# EAGLE design 454_mic101 (EAGLE 9.6.0)
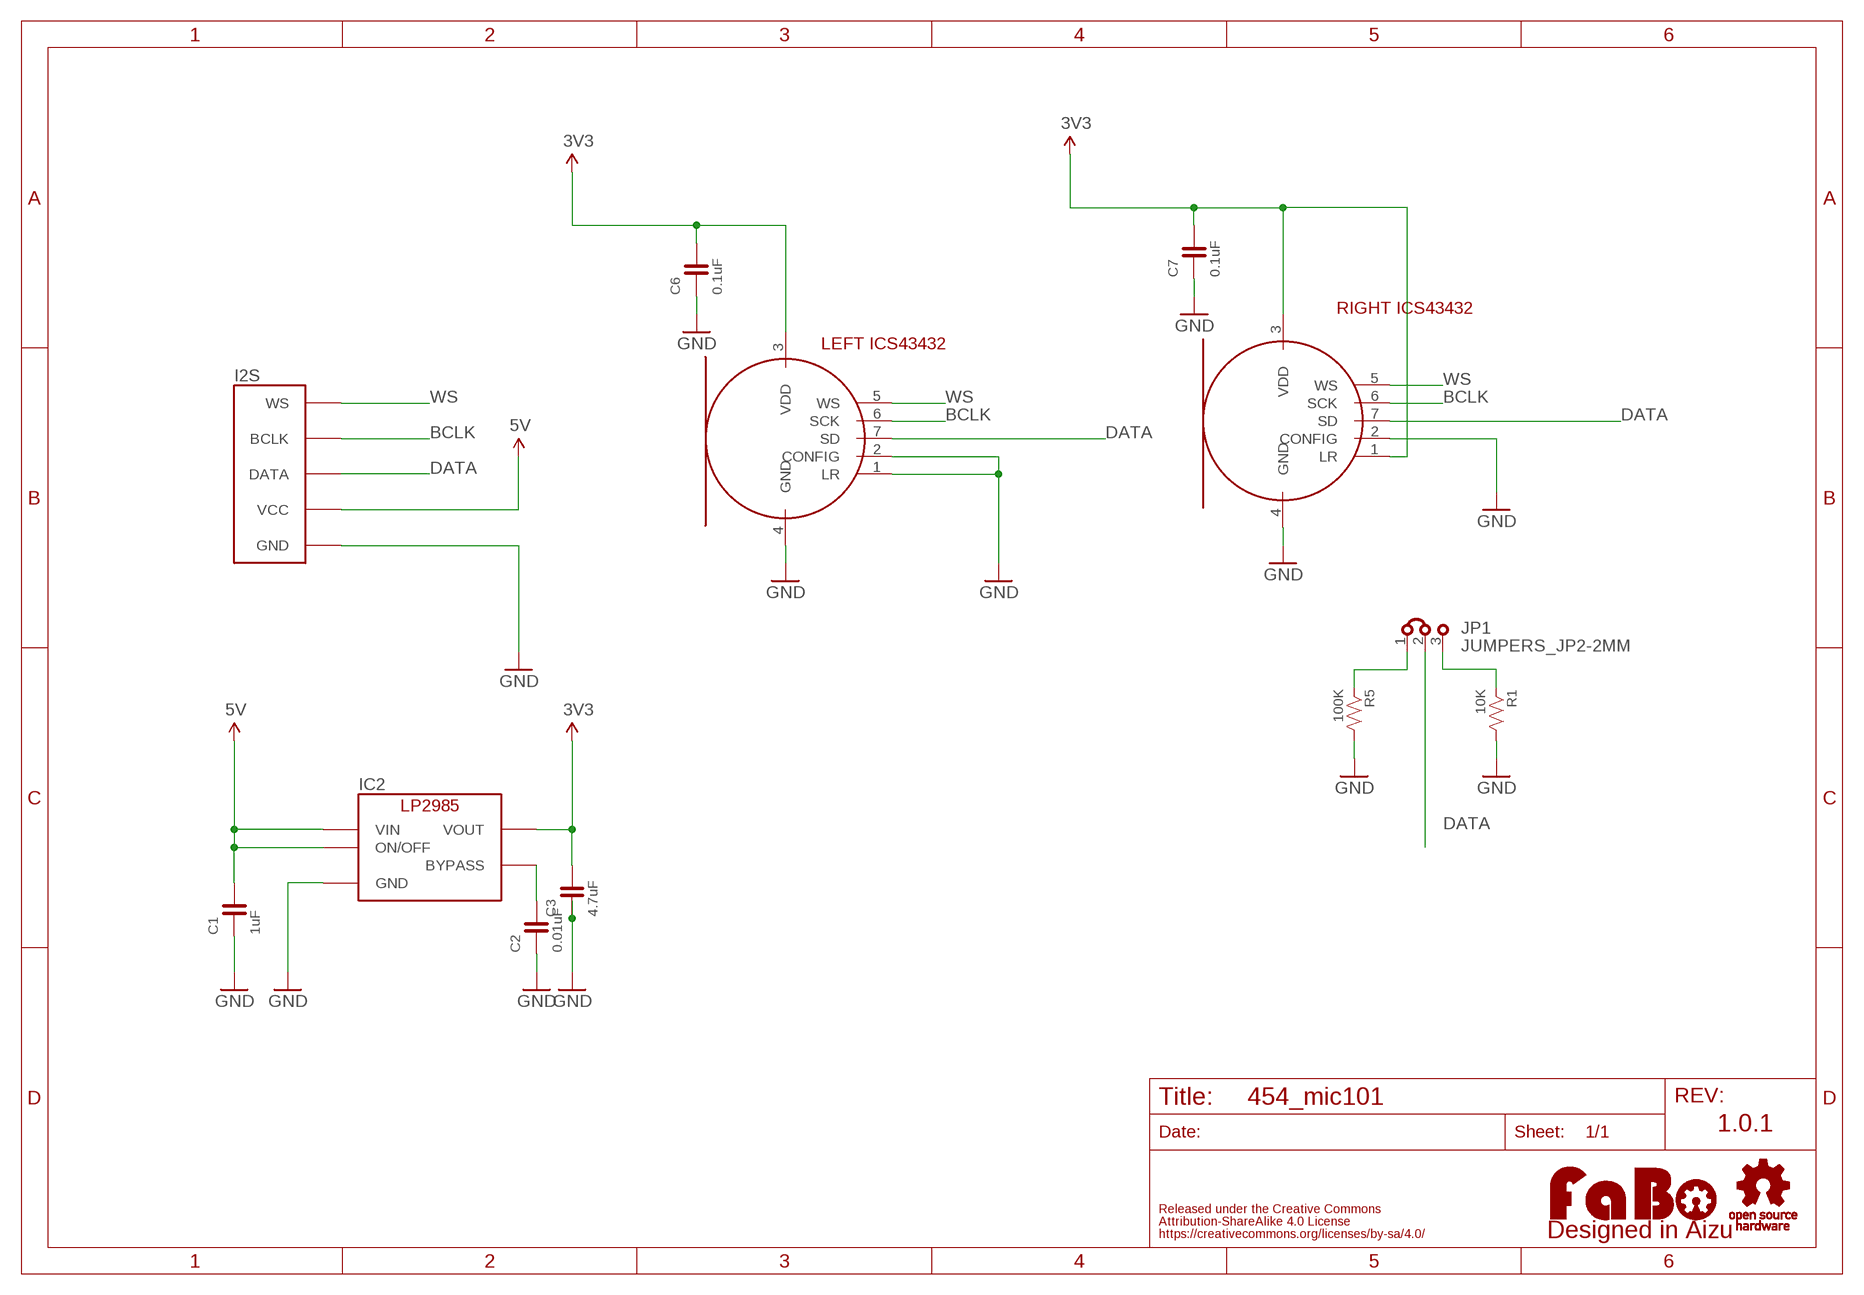
[diagram p0: schematic, sheet 1]

## Parts
C1  1uF  CAPACITOR-0603  [0603]
C2  0.01uF  CAPACITOR-0603  [0603]
C3  4.7uF  CAPACITOR-0603  [0603]
C6  0.1uF  CAPACITOR-0603  [0603]
C7  0.1uF  CAPACITOR-0603  [0603]
I2S  FABO_BRICK_I2STOP  [FABO_BRICK_I2S_B05B-PARK-1]
IC2  LP2985-33DBV  [SOT-23-5]
JP1  JUMPERS_JP2-2MM  [JUMPERS_JP2-2MM]
LOGO1  LOGO_FABO-M_BOTTOM  [LOGO_FABO_M_BOTTOM]
MIC_LEFT  TDK-ICS43432  [TDK-ICS43432]
MIC_RIGHT  TDK-ICS43432  [TDK-ICS43432]
R1  10K  RESISTOR-0603  [0603]
R5  100K  RESISTOR-0603  [0603]
U$2  LOGO_OSHW-M  [LOGO_OSHW_M]

## Nets
3V3: C3.2 C6.2 C7.2 IC2.5(VOUT) MIC_LEFT.3(VDD) MIC_RIGHT.1(LR) MIC_RIGHT.3(VDD)
5V: C1.2 I2S.VCC IC2.1(VIN) IC2.3(ON/OFF)
BCLK: I2S.BCLK MIC_LEFT.6(SCK) MIC_RIGHT.6(SCK)
DATA: I2S.DATA JP1.2 MIC_LEFT.7(SD) MIC_RIGHT.7(SD)
GND: C1.1 C2.1 C3.1 C6.1 C7.1 I2S.GND IC2.2(GND) MIC_LEFT.1(LR) MIC_LEFT.2(CONFIG) MIC_LEFT.4(GND) MIC_RIGHT.2(CONFIG) MIC_RIGHT.4(GND) R1.2 R5.2
N$1: C2.2 IC2.4(BYPASS)
N$2: JP1.1 R5.1
N$3: JP1.3 R1.1
WS: I2S.WS MIC_LEFT.5(WS) MIC_RIGHT.5(WS)

## Notes on the sheet
- RIGHT ICS43432
- LEFT ICS43432
- 1.0.1

## Library data of the parts
C1-C3 C6 C7 = FaBo-Capacitor:CAPACITOR: CAPACITOR
I2S = FaBo-Template:FABO_BRICK_I2S
IC2 = FaBo-Supply:LP2985: LP2985
JP1 = 52101-101-REV-A_v16:JUMPERS_JP2-: Jumper/Bridge
LOGO1 = component:LOGO_FABO
MIC_LEFT MIC_RIGHT = FaBo-Mems:TDK-ICS43432
R1 R5 = FaBo-Resistors:RESISTOR: RESISTOR
U$2 = component:LOGO_OSHW

## Board
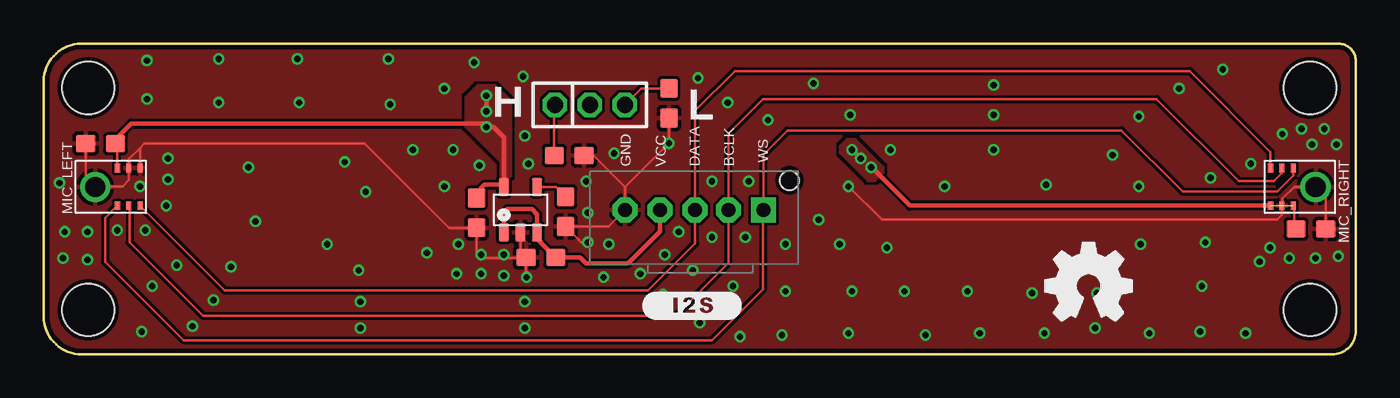
[diagram p1: board, top side]
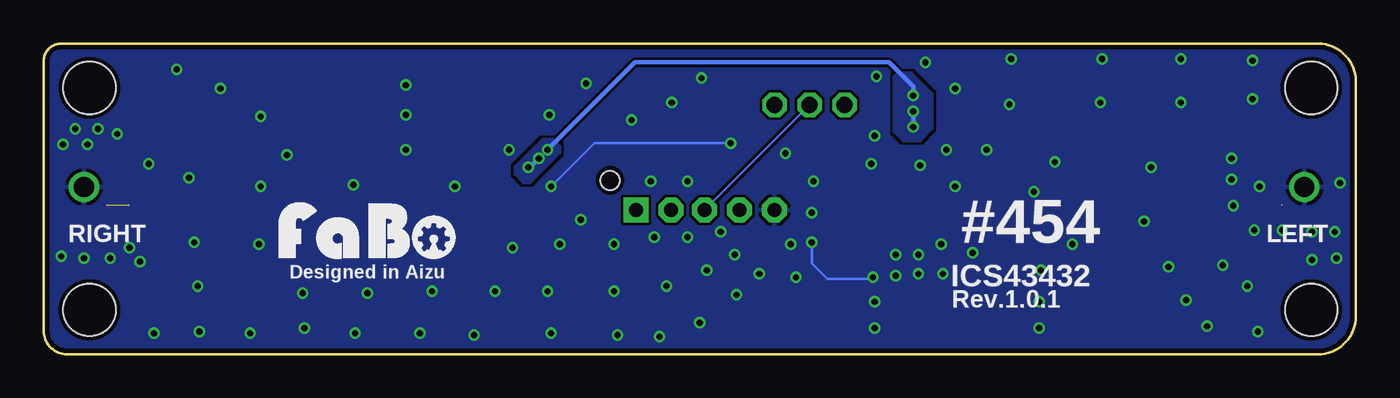
[diagram p2: board, bottom side, seen from below]

Size 75 x 17.77 mm. Coordinates in mm from the lower left corner, seen from the top.
Outline: 0,2.17 0,15.62 arc-90 2.15,17.77 74.01,17.77 arc-90 75,16.78 75,1.34 arc-90 73.66,0 2.17,0 arc-90 0,2.17
Copper layers (1*16): Top 0.035mm / dielectric 1.6mm / Bottom 0.035mm
Design rules "PCBway": minimum track width 6mil, minimum drill 12mil, track to track 6mil, track to pad 6mil, pad to pad 6mil, via to via 6mil, smd to smd 6mil, copper to edge 10mil, drill to drill 10mil, minimum pad ring 10mil, minimum via ring 6mil, stop-mask expansion 2mil, vias tented up to drill 100mil, thermal gap 8mil
Holes 3 mm at 2.54,2.54 2.54,15.24 72.39,15.24 72.39,2.54

### Footprints (pad centres in the part's own frame; a part is rotated, then mirrored left to right if it is on the bottom)
0603 = smd 1.1 x 1: 1 -0.85,0; 2 0.85,0
FABO_BRICK_I2S_B05B-PARK-1 = drill 0.8 pad 1.422 octagon: BCLK 1.635,2.54; DATA -0.27,2.54; GND -4.27,2.54; VCC -2.27,2.54 | drill 0.8 pad 1.422 square: WS 3.635,2.54 | hole 1.1: 5.135,4.24
SOT-23-5 = smd 0.6 x 1.05: 1 -0.95,-1.3; 2 0,-1.3; 3 0.95,-1.3; 4 0.95,1.3; 5 -0.95,1.3
JUMPERS_JP2-2MM = drill 0.914 octagon: 1 -2,0; 2 0,0; 3 2,0
TDK-ICS43432 = smd 0.5 x 0.3: 1 1.075,-2.575; 2 1.075,-1.925; 3 1.075,-1.275; 5 -1.075,-1.275; 6 -1.075,-1.925; 7 -1.075,-2.575 | drill 1.15 pad 1.65: 4 0,0

### Placement (x,y rotation side)
C1  28.41,5.53 0 top
C2  29.84,8.16 90 top
C3  24.74,8.09 90 top
C6  3.25,12.05 0 top
C7  72.44,7.17 180 top
I2S  37.5,5.71 0 top
IC2  27.25,8.27 0 top
JP1  31.21,14.27 0 top
LOGO1  56.52,5.08 0 top
MIC_LEFT  2.94,9.57 90 top
MIC_RIGHT  72.7,9.57 270 top
R1  35.74,14.36 270 top
R5  30.03,11.37 0 top
U$2  59.74,3.91 0 top

### Tracks (layer width: path | path; a pad name or v marks a point on that pad's centre or on a via)
3V3  (via drill 0.35)  (1 unrouted)
  Top 0.152: MIC_LEFT.3 4.21,11.94 C6.2 | MIC_RIGHT.3 71.48,8.44 71.48,7.27 C7.2
  Top 0.254: MIC_RIGHT.1 49.5,8.5 v47.3,10.7 | v46.7,11.2 v46.2,11.7 | v25.3,14.8 v25.3,13.9 | C6.2 4.1,12.3 5,13.2 25.1,13.2 v25.3,13 25.7,13 26.3,12.4 26.3,9.7 | IC2.5 26.3,9.7 | C3.2 24.74,9.24 25.2,9.7 26.3,9.7
  Bottom 0.254: v47.3,10.7 47.2,10.7 v46.7,11.2 | v46.2,11.7 41.2,16.7 26.7,16.7 25.3,15.3 v25.3,14.8 | v25.3,13.9 v25.3,13
  pour Bottom (no thermals): 25.6,12.2 24.9,12.2 24.2,12.9 24.2,14.9 25.4,16.1 26.2,16.1 26.4,15.9 26.4,12.7 25.9,12.2
  pour Top (no thermals): 24.9,12.2 24.1,13 24.1,13.2 24.1,14.7 24.6,15.2 24.8,15.4 25.8,15.4 26.7,14.5 26.7,10.8 26.7,10.2 26.5,10 26.1,10 26.1,11
  pour Top (no thermals): 47.5,9.9 47.1,9.9 45.5,11.5 45.5,11.9 45.9,12.3 46.4,12.3 48,10.7 48,10.4
  pour Bottom (no thermals): 45.5,11.6 45.5,11.9 45.9,12.3 46.2,12.3 46.5,12.3 48,10.8 48.1,10.7 48.1,10.3 47.6,9.8 47.2,9.8 47.1,9.9 45.5,11.5
5V
  Top 0.152: 28.2,6.8 IC2.3
  Top 0.254: IC2.1 26.3,8.1 26.5,8.3 27.9,8.3 28.2,8 28.2,6.8 28.2,6.59 C1.2 30.67,5.53 31,5.2 33.4,5.2 35.23,7.03 I2S.VCC
BCLK
  Top 0.152: MIC_LEFT.6 4.9,8.46 4.9,6.4 9.1,2.2 36.1,2.2 39.13,5.24 I2S.BCLK 39.13,12.63 41.1,14.6 63.6,14.6 68.3,9.9 70.3,9.9 70.78,10.38 MIC_RIGHT.6
  Bottom 0.152: 39.17,8.38 I2S.BCLK
DATA
  Top 0.152: MIC_LEFT.7 10.35,3.65 34.55,3.65 37.23,6.33 I2S.DATA 37.23,13.93 39.5,16.2 65.5,16.2 70.12,11.57 MIC_RIGHT.7
  Bottom 0.152: I2S.DATA JP1.2
GND  (via drill 0.35)
  Top 0.152: IC2.2 27.25,5.84 C1.1 | v31.1,6.4 30.7,6.4 30.6,6.5 30.6,6.55 C2.1 32.28,7.31 I2S.GND 33.23,9.57 | v27.6,4.4 27.6,4.5 27.57,4.54 C1.1 | R5.2 31.43,11.37 33.23,9.57 | R1.2 v35.74,12.08 33.23,9.57 | C1.1 27.54,5.5 25,5.5 24.74,5.76 C3.1 23.16,7.24 18.35,12.05 5.75,12.05 5.51,11.81 | C6.1 2.4,10.11 MIC_LEFT.4 2.96,9.6 4.5,9.6 4.86,9.96 MIC_LEFT.2 4.86,11.16 5.51,11.81 | MIC_LEFT.1 5.51,11.81 | C7.1 73.28,8.99 MIC_RIGHT.4 71.47,9.57 70.8,8.9 70.8,8.53 MIC_RIGHT.2 70.78,7.97 70.5,7.7 47.9,7.7 v46,9.6
  Bottom 0.152: v31.1,6.4 31.1,5.2 30.2,4.3 27.7,4.3 v27.6,4.4 | v46,9.6 43.52,12.08 v35.74,12.08
  other vias: 38.2,9.9 40.3,9.9 41.4,13.4 39.1,14.4 44,15.5 46.1,13.7 62.6,13.6 66.7,10.1 69,10.9 64.9,15.2 54.3,15.4 54.3,13.7 26.3,5.7 26.3,4.5 25,4.6 25,5.7 23.7,6.3 23.6,4.6 24.9,10.8 27.7,10.9 31.1,8.1 31,9.9 32.6,11.5 5.8,7.1 4.2,7.1 9.7,3.1 8.5,1.6 38.2,6.7 40.1,6.7 37.5,1.8 35.4,3.4 18.1,3 27.5,3 27.5,1.5 18.1,1.5 7,8.5 10.7,5 18,4.8 36.3,7 34.1,4.6 32.3,6.3 32,4.4 21.9,5.8 22.9,9.6 27.5,12.5 24.6,16.7 22.9,15.2 54.3,11.7 48.4,11.7 61.1,11.4 67.4,16.3 70.8,12.6 73.9,12 72.5,12 74,5.6 72.7,5.5 71.2,5.5 51.5,9.6 57.3,9.7 62.6,9.6 2.5,7 1.2,7 1.1,5.5 2.5,5.4 7.1,11.2 5.9,14.6 5.9,16.8 14.5,16.9 10,16.9 19.7,16.9 19.8,14.3 14.6,14.4 10,14.4 21.1,11.7 17.2,11 11.7,10.7 12.1,7.6 16.2,6.3 18.4,9.3 23.4,11.7 5.6,1.3 7.1,10 5.5,9.6 0.9,9.8 73.2,12.9 71.9,12.9 70.1,6.1 69.5,5.3 68.7,1.2 63.2,1.2 57.2,1.2 50.4,1.1 42.2,1.1 44.3,7.7 42.4,6.3 42.4,3.6 48.2,6.1 62.7,6.3 66.4,6.4 56.5,3.5 46.2,3.6 66.1,1.3 53.5,1.2 46,1.2 45.5,6.3 49.2,3.6 66.2,3.9 60.1,1.5 60.2,3.5 52.8,3.6 37.4,15.8 27.4,15.9 39.4,3.9 37.1,4.8 35.5,5.7 39.8,1 7.6,5.1 6.2,3.9
  pour Top (rank 6): 0,0 74.93,0 74.93,17.78 0,17.78
  pour Bottom (rank 6): -0.9,0 74.93,0 74.93,17.78 -0.9,17.78
N$1
  Top 0.152: C2.2 29.28,9.57 IC2.4
N$2
  Top 0.152: R5.1 29.18,14.23 JP1.1
N$3
  Top 0.152: JP1.3 34.16,15.21 R1.1
WS  (1 unrouted)
  Top 0.152: 4.27,8.69 4.27,8.53 | MIC_LEFT.5 3.51,7.8 3.51,5.29 8,0.8 38.2,0.8 41.1,3.7 41.1,8.22 I2S.WS 41.13,11.44 42.5,12.8 61.6,12.8 65.1,9.3 70.5,9.3 71.42,10.22 MIC_RIGHT.5

### Text on the board
tPlace: H | L | GND | VCC | DATA | BCLK | WS
bPlace: LEFT | #454 | RIGHT | Designed in Aizu | ICS43432 | Rev.1.0.1